# EAGLE design tinypilot_pcb (EAGLE 7.7.0)
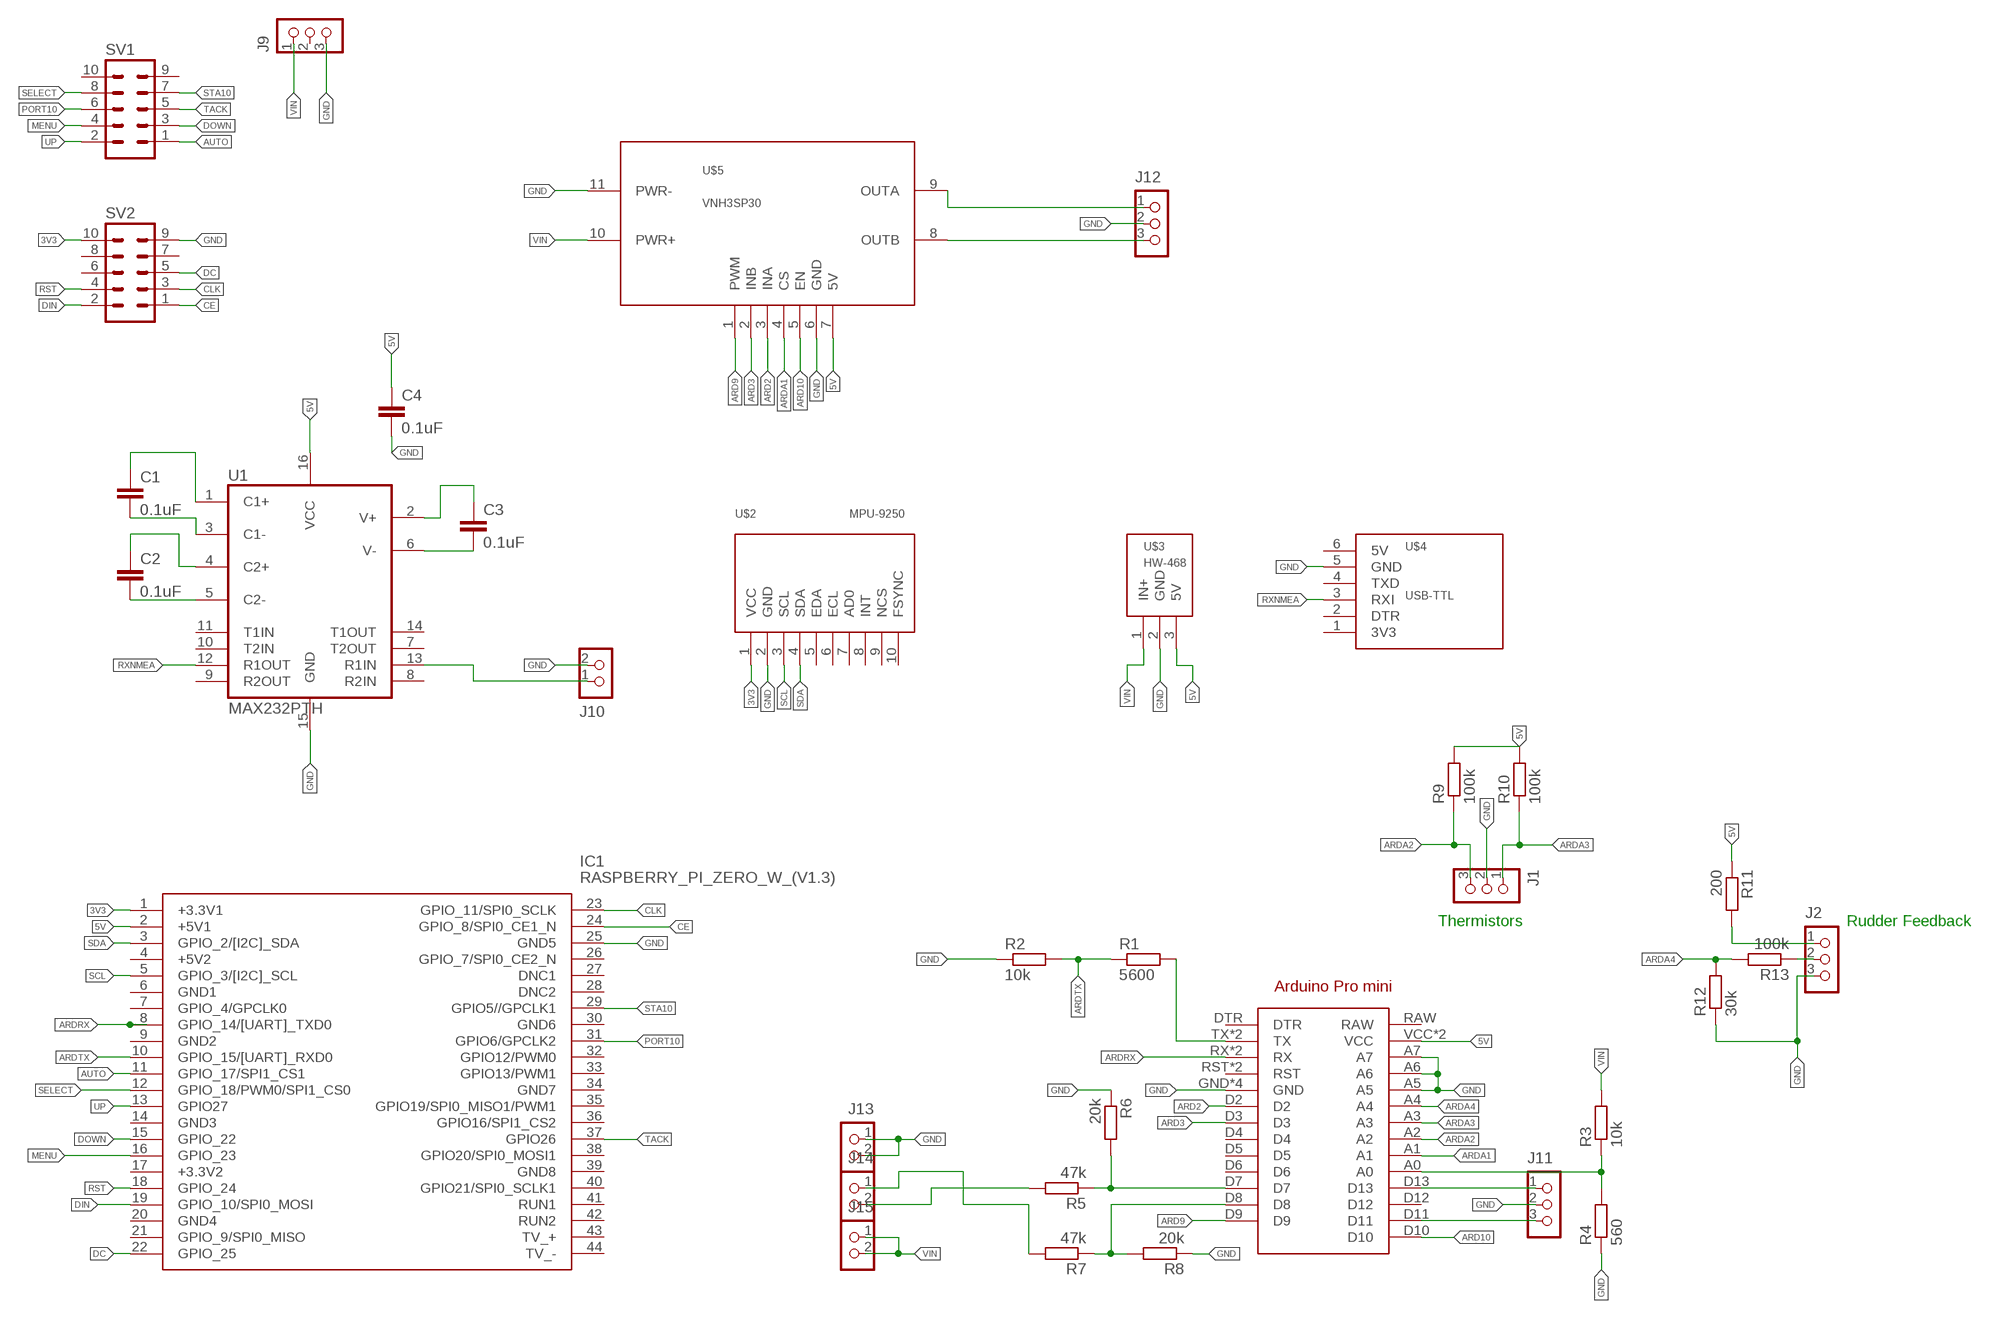
[diagram p0: schematic, sheet 1]

## Parts
ARDUINO1  ARDUINO_PRO_MINI  [ARDUINO_PRO_MINI]
C1  0.1uF  CAPPTH1  [CAP-PTH-5MM]
C2  0.1uF  CAPPTH1  [CAP-PTH-5MM]
C3  0.1uF  CAPPTH1  [CAP-PTH-5MM]
C4  0.1uF  CAPPTH1  [CAP-PTH-5MM]
IC1  RASPBERRY_PI_ZERO_W_(V1.3)  [RASPBERRYPIZEROWV13]
J1  CON_TERMINAL_BLOCK_03-5MM  [TERMINAL_BLOCK_3P_5]
J2  CON_TERMINAL_BLOCK_03-5MM  [TERMINAL_BLOCK_3P_5]
J9  CON_TERMINAL_BLOCK_03-5MM  [TERMINAL_BLOCK_3P_5]
J10  CON_TERMINAL_BLOCK_02-5MM  [TERMINAL_BLOCK_2P_5]
J11  CON_TERMINAL_BLOCK_03-5MM  [TERMINAL_BLOCK_3P_5]
J12  CON_TERMINAL_BLOCK_03-5MM  [TERMINAL_BLOCK_3P_5]
J13  CON_TERMINAL_BLOCK_02-5MM  [TERMINAL_BLOCK_2P_5]
J14  CON_TERMINAL_BLOCK_02-5MM  [TERMINAL_BLOCK_2P_5]
J15  CON_TERMINAL_BLOCK_02-5MM  [TERMINAL_BLOCK_2P_5]
R1  5600  R-EU_0207/10  [0207/10]
R2  10k  R-EU_0207/10  [0207/10]
R3  10k  R-EU_0207/10  [0207/10]
R4  560  R-EU_0207/10  [0207/10]
R5  47k  R-EU_0207/10  [0207/10]
R6  20k  R-EU_0207/10  [0207/10]
R7  47k  R-EU_0207/10  [0207/10]
R8  20k  R-EU_0207/10  [0207/10]
R9  100k  R-EU_0207/10  [0207/10]
R10  100k  R-EU_0207/10  [0207/10]
R11  200  R-EU_0207/10  [0207/10]
R12  30k  R-EU_0207/10  [0207/10]
R13  100k  R-EU_0207/10  [0207/10]
SV1  ML10  [ML10]
SV2  ML10  [ML10]
U1  MAX232PTH  [DIL16]
U$2  MPU-9250  [MPU-9250]
U$3  HW-468  [HW-468]
U$4  USB-TTL  [USB-TTL]
U$5  VNH3SP30  [VNH3SP30]

## Nets
3V3: IC1.1(+3.3V1) SV2.10 U$2.1(VCC)
5V: ARDUINO1.VCC ARDUINO1.VCC@1(VCC) C4.1 IC1.2(+5V1) R9.2 R10.2 R11.1 U1.16(VCC) U$3.3(5V) U$5.7(5V)
ARD2: ARDUINO1.D2 U$5.3(INA)
ARD3: ARDUINO1.D3 U$5.2(INB)
ARD9: ARDUINO1.D9 U$5.1(PWM)
ARD10: ARDUINO1.D10 U$5.5(EN)
ARDA1: ARDUINO1.A1 U$5.4(CS)
ARDA2: ARDUINO1.A2 J1.3 R9.1
ARDA3: ARDUINO1.A3 J1.1 R10.1
ARDA4: ARDUINO1.A4 R12.2 R13.2
ARDRX: ARDUINO1.RX ARDUINO1.RX@1(RX) IC1.8(GPIO_14/[UART]_TXD0)
ARDTX: IC1.10(GPIO_15/[UART]_RXD0) R1.1 R2.2
AUTO: IC1.11(GPIO_17/SPI1_CS1) SV1.1
CE: IC1.24(GPIO_8/SPI0_CE1_N) SV2.1
CLK: IC1.23(GPIO_11/SPI0_SCLK) SV2.3
DC: IC1.22(GPIO_25) SV2.5
DIN: IC1.19(GPIO_10/SPI0_MOSI) SV2.2
DOWN: IC1.15(GPIO_22) SV1.3
GND [GND]: ARDUINO1.A5 ARDUINO1.A6 ARDUINO1.A7 ARDUINO1.GND ARDUINO1.GND@1(GND) ARDUINO1.GND@2(GND) ARDUINO1.GND@3(GND) C4.2 IC1.25(GND5) J1.2 J2.3 J9.3 J10.2 J11.2 J12.2 J13.1 J13.2 R2.1 R4.1 R6.1 R8.1 R12.1 SV2.9 U1.15(GND) U$2.2(GND) U$3.2(GND) U$4.5(GND) U$5.6(GND) U$5.11(PWR-)
MENU: IC1.16(GPIO_23) SV1.4
N$1: C1.1 U1.1(C1+)
N$2: C1.2 U1.3(C1-)
N$3: C2.1 U1.4(C2+)
N$4: C2.2 U1.5(C2-)
N$5: C3.2 U1.6(V-)
N$6: C3.1 U1.2(V+)
N$7: J14.2 R5.2
N$8 [VIN]: J12.1 U$5.9(OUTA)
N$9 [VIN]: J12.3 U$5.8(OUTB)
N$10: ARDUINO1.D13 J11.1
N$11: ARDUINO1.D11 J11.3
N$12: ARDUINO1.A0 R3.1 R4.2
N$13: ARDUINO1.D7 R5.1 R6.2
N$14: ARDUINO1.TX ARDUINO1.TX@1(TX) R1.2
N$15: ARDUINO1.D8 R7.1 R8.2
N$17: J14.1 R7.2
N$20: J2.1 R11.2
N$21: J2.2 R13.1
PORT10: IC1.31(GPIO6/GPCLK2) SV1.6
R1IN [GND]: J10.1 U1.13(R1IN)
RST: IC1.18(GPIO_24) SV2.4
RXNMEA: U1.12(R1OUT) U$4.3(RXI)
SCL: IC1.5(GPIO_3/[I2C]_SCL) U$2.3(SCL)
SDA: IC1.3(GPIO_2/[I2C]_SDA) U$2.4(SDA)
SELECT: IC1.12(GPIO_18/PWM0/SPI1_CS0) SV1.8
STA10: IC1.29(GPIO5//GPCLK1) SV1.7
TACK: IC1.37(GPIO26) SV1.5
UP: IC1.13(GPIO27) SV1.2
VIN [VIN]: J9.1 J15.1 J15.2 R3.2 U$3.1(IN+) U$5.10(PWR+)
Unconnected: ARDUINO1.D4 ARDUINO1.D5 ARDUINO1.D6 ARDUINO1.D12 ARDUINO1.DTR ARDUINO1.RAW ARDUINO1.RST ARDUINO1.RST@1(RST) IC1.4(+5V2) IC1.6(GND1) IC1.7(GPIO_4/GPCLK0) IC1.9(GND2) IC1.14(GND3) IC1.17(+3.3V2) IC1.20(GND4) IC1.21(GPIO_9/SPI0_MISO) IC1.26(GPIO_7/SPI0_CE2_N) IC1.27(DNC1) IC1.28(DNC2) IC1.30(GND6) IC1.32(GPIO12/PWM0) IC1.33(GPIO13/PWM1) IC1.34(GND7) IC1.35(GPIO19/SPI0_MISO1/PWM1) IC1.36(GPIO16/SPI1_CS2) IC1.38(GPIO20/SPI0_MOSI1) IC1.39(GND8) IC1.40(GPIO21/SPI0_SCLK1) IC1.41(RUN1) IC1.42(RUN2) IC1.43(TV_+) IC1.44(TV_-) J9.2 SV1.9 SV1.10 SV2.6 SV2.7 SV2.8 U1.7(T2OUT) U1.8(R2IN) U1.9(R2OUT) U1.10(T2IN) U1.11(T1IN) U1.14(T1OUT) U$2.5(EDA) U$2.6(ECL) U$2.7(AD0) U$2.8(INT) U$2.9(NCS) U$2.10(FSYNC) U$4.1(3V3) U$4.2(DTR) U$4.4(TXD) U$4.6(5V)

## Notes on the sheet
- Thermistors | Rudder Feedback

## Library data of the parts
ARDUINO1 = arduinopromini:ARDUINO_PRO_MINI: For creating Arduino Pro Mini shields
C1-C4 = SparkFun:CAP: Capacitor Standard 0603 ceramic capacitor, and 0.1" leaded capacitor.
IC1 = Raspberry_Pi_Zero_W_(v1.3):RASPBERRY_PI_ZERO_W_(V1.3): Raspberry Pi Zero W (v1.3) Single-board Computers Source: Datasheet <https://cdn.sparkfun.com/assets/learn_tutorials/6/7/6/PiZero_1.pdf>; ARROW_PART_NUMBER: Raspberry Pi Zero W (v1.3); DESCRIPTION: Raspberry Pi Zero W (v1.3) Single-board Computers; HEIGHT: mm; MANUFACTURER_NAME: RASPBERRY-PI; MANUFACTURER_PART_NUMBER: Raspberry Pi Zero W (v1.3)
J1 J2 J9 J11 J12 = dp_devices.v6:CON_TERMINAL_BLOCK_03: 3 poles, wire to board connector
J10 J13-J15 = dp_devices.v6:CON_TERMINAL_BLOCK_02: 2 poles wire to board terminal block
R1-R13 = resistor:R-EU_: RESISTOR, European symbol
SV1 SV2 = con-ml:ML10: HARTING
U1 = SparkFun:MAX232: RS232 Transceiver Very common IC. This is generically called 'MAX232', but works with the 3V equivalent MAX3232 generic ICs. Field tested and mother approved. Spark Fun Electronics SKU : COM-00316 (DIP) and COM-00589 (SMD)
U$2 = Pypilot:MPU-9250
U$3 = Pypilot:HW-468
U$4 = Pypilot:USB-TTL
U$5 = Pypilot:VNH3SP30

## Net classes
0 default: width 0.635 mm, clearance 0.254 mm
1 VIN: width 2.54 mm, clearance 0.762 mm
2 GND: width 2.54 mm, clearance 0.762 mm

## Board
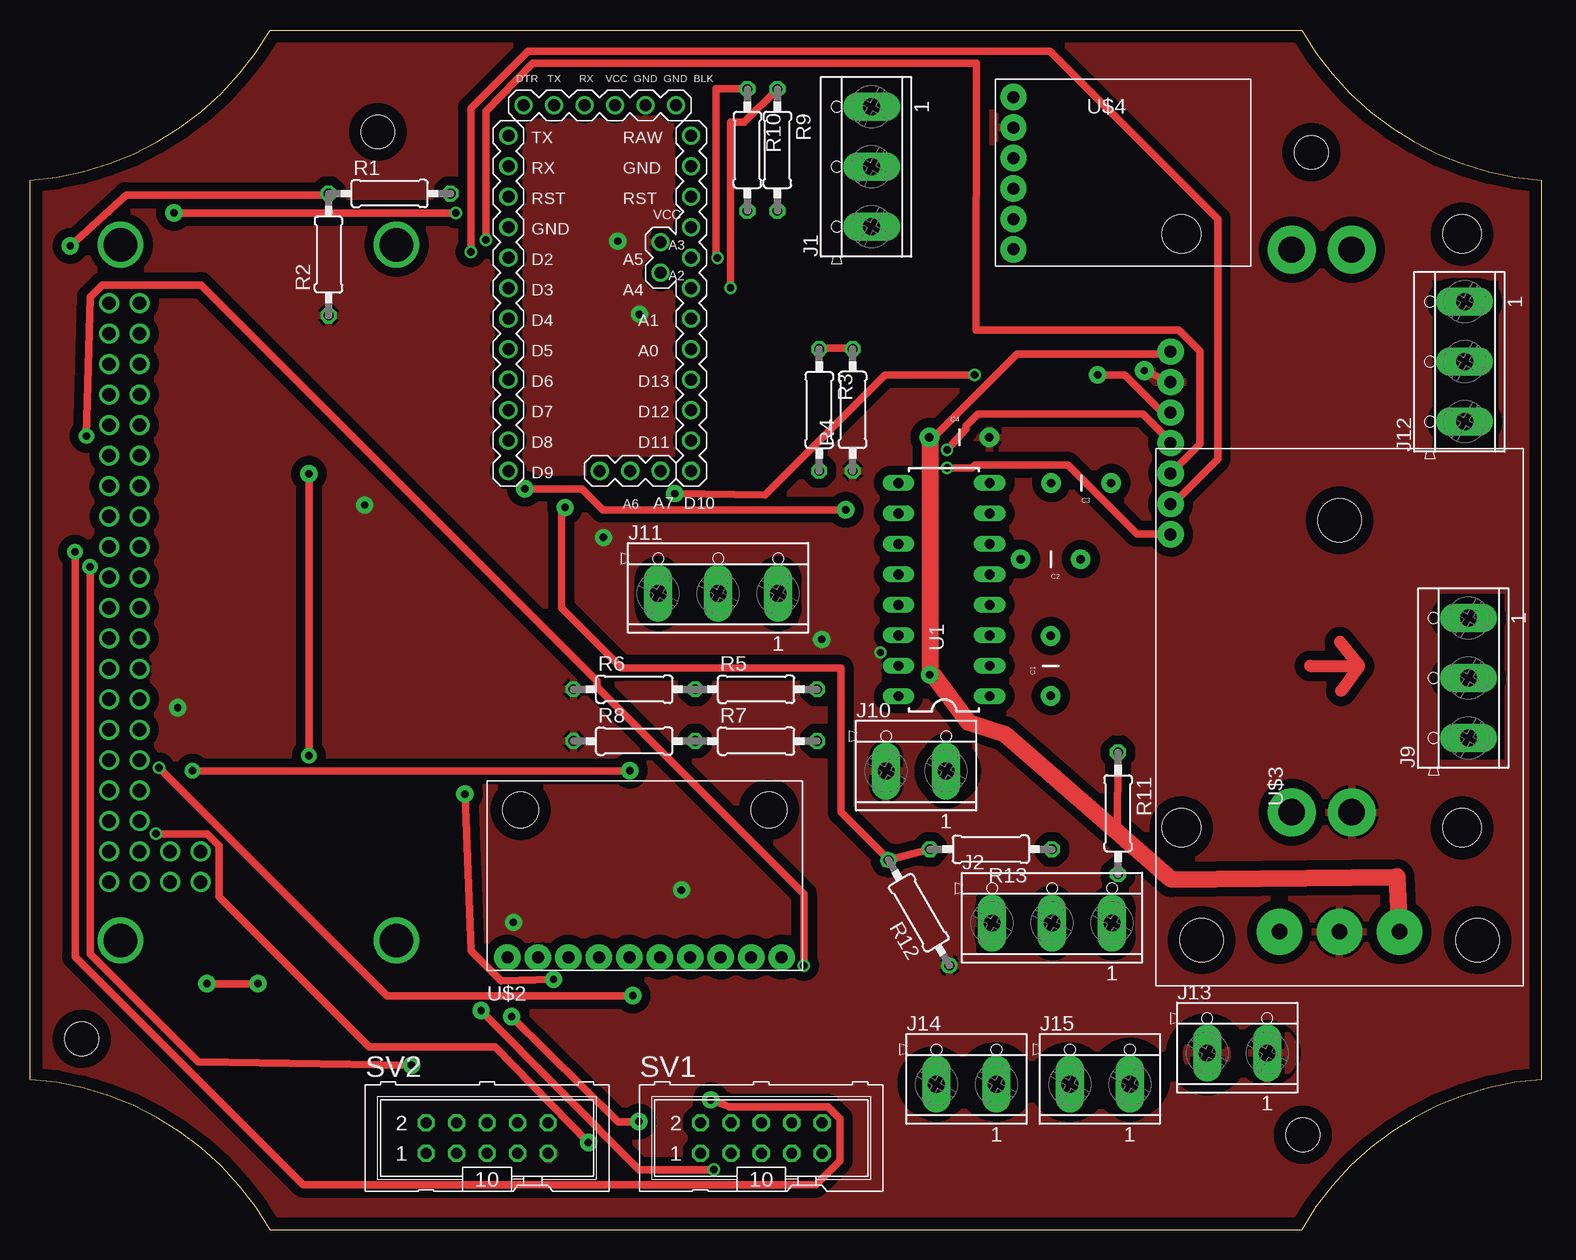
[diagram p1: board, top side]
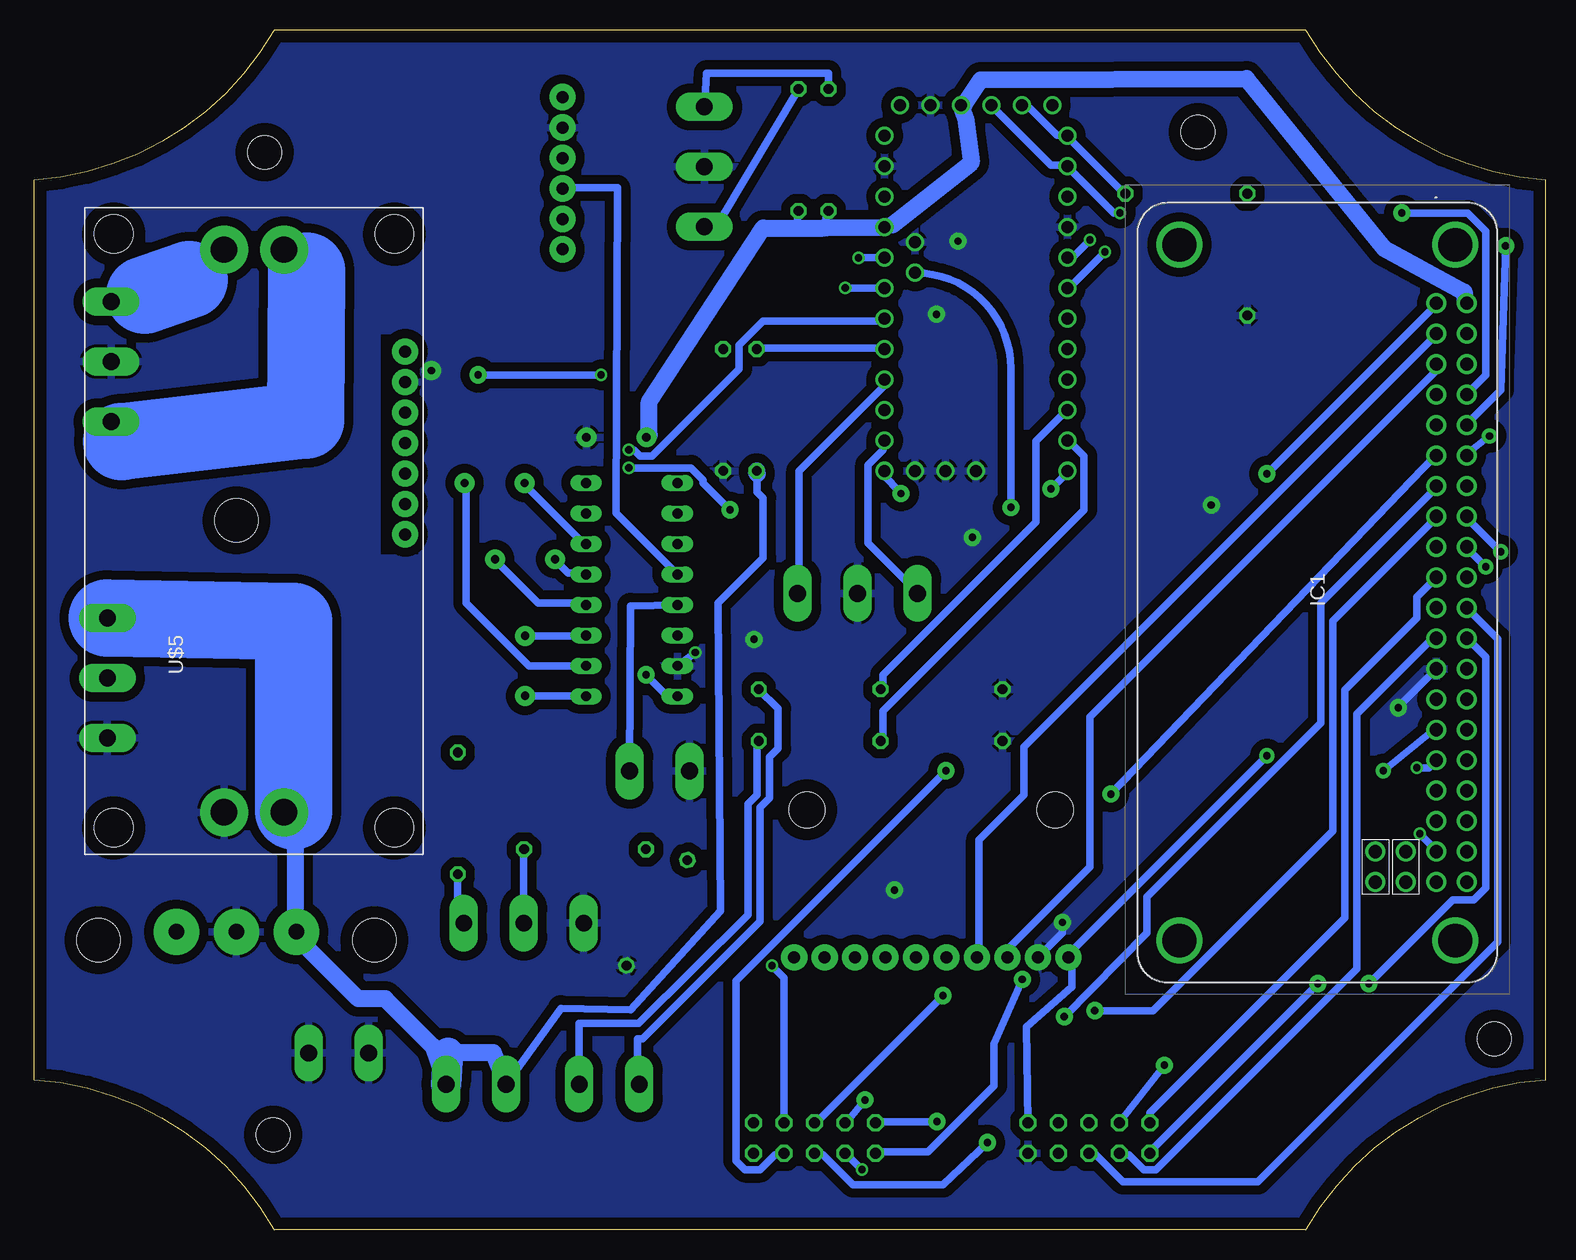
[diagram p2: board, bottom side, seen from below]

Size 126 x 100 mm. Coordinates in mm from the lower left corner, seen from the top.
Outline: 0,87.5 arc56 20,100
Outline: 106,100 arc56 126,87.5
Outline: 126,12.5 arc56 106,0
Outline: 20,0 arc56 0,12.5
Outline: 20,0 106,0
Outline: 0,12.5 0,87.5
Outline: 20,100 106,100
Outline: 126,12.5 126,87.5
Outline: 126,12.5 arc56 106,0
Outline: 20,0 arc56 0,12.5
Outline: 0,87.5 arc56 20,100
Outline: 106,100 arc56 126,87.5
Copper layers (1*16): Top 0.035mm / dielectric 1.5mm / Bottom 0.035mm
Design rules "default *": minimum track width 10mil, minimum drill 24mil, track to track 8mil, track to pad 8mil, pad to pad 8mil, via to via 8mil, smd to smd 8mil, copper to edge 40mil, drill to drill 8mil, minimum pad ring 10mil, minimum via ring 8mil, stop-mask expansion 4mil, vias tented up to drill 0mil, thermal gap 10mil
Holes 2.8 mm at 106.1,7.9 4.3,15.9 106.8,89.8 29,91.5
tRestrict: area 5.6,76.2 to 7.6,78.2; area 8,76.1 to 10.2,78.3; area 8.4,74 to 9.8,75.4; area 5.9,74 to 7.3,75.4; area 5.9,71.4 to 7.3,72.8; area 8.3,71.3 to 9.9,72.9; area 5.8,68.7 to 7.4,70.3; area 5.7,66.1 to 7.5,67.9; area 5.8,63.7 to 7.4,65.3; area 8.3,63.7 to 9.9,65.3; area 8.4,61.1 to 10,62.7; area 8.2,58.5 to 10,60.3; 49 more areas
bRestrict: area 94,56.3 to 97.1,74.6

### Footprints (pad centres in the part's own frame; a part is rotated, then mirrored left to right if it is on the bottom)
ARDUINO_PRO_MINI = drill 1: A0 11.43,-8.89; A1 11.43,-6.35; A2 11.43,-3.81; A3 11.43,-1.27; A4 8.89,-2.54; A5 8.89,0; A6 6.35,-19.05; A7 8.89,-19.05; BLK 10.16,11.43; D2 -3.81,-1.27; D3 -3.81,-3.81; D4 -3.81,-6.35; D5 -3.81,-8.89; D6 -3.81,-11.43; D7 -3.81,-13.97; D8 -3.81,-16.51; D9 -3.81,-19.05; D10 11.43,-19.05; D11 11.43,-16.51; D12 11.43,-13.97; D13 11.43,-11.43; DTR -2.54,11.43; GND -3.81,1.27; GND@1 11.43,6.35; GND@2 7.62,11.43; GND@3 3.81,-19.05; RAW 11.43,8.89; RST 11.43,3.81; RST@1 -3.81,3.81; RX -3.81,6.35; RX@1 2.54,11.43; TX -3.81,8.89; TX@1 0,11.43; VCC 11.43,1.27; VCC@1 5.08,11.43
CAP-PTH-5MM = drill 0.7 pad 1.651: 1 -2.5,0; 2 2.5,0
RASPBERRYPIZEROWV13 = drill 1.11: 1 -23.885,9.92; 2 -23.885,12.46; 3 -21.345,9.92; 4 -21.345,12.46; 5 -18.805,9.92; 6 -18.805,12.46; 7 -16.265,9.92; 8 -16.265,12.46; 9 -13.725,9.92; 10 -13.725,12.46; 11 -11.185,9.92; 12 -11.185,12.46; 13 -8.645,9.92; 14 -8.645,12.46; 15 -6.105,9.92; 16 -6.105,12.46; 17 -3.565,9.92; 18 -3.565,12.46; 19 -1.025,9.92; 20 -1.025,12.46; 21 1.515,9.92; 22 1.515,12.46; 23 4.055,9.92; 24 4.055,12.46; 25 6.595,9.92; 26 6.595,12.46; 27 9.135,9.92; 28 9.135,12.46; 29 11.675,9.92; 30 11.675,12.46; 31 14.215,9.92; 32 14.215,12.46; 33 16.755,9.92; 34 16.755,12.46; 35 19.295,9.92; 36 19.295,12.46; 37 21.835,9.92; 38 21.835,12.46; 39 24.375,9.92; 40 24.375,12.46; 41 24.375,7.38; 42 21.835,7.38; 43 21.835,4.84; 44 24.375,4.84 | drill 2.8: 45 -28.755,11.5; 46 -28.755,-11.5; 47 29.245,-11.5; 48 29.245,11.5
TERMINAL_BLOCK_3P_5 = drill 1.4 pad 2.38 long: 1 5,-0.45; 2 0,-0.45; 3 -5,-0.45
TERMINAL_BLOCK_2P_5 = drill 1.4 pad 2.38 long: 1 2.5,-0.45; 2 -2.5,-0.45
0207/10 = drill 0.813 octagon: 1 -5.08,0; 2 5.08,0
ML10 = drill 0.914 octagon: 1 -5.08,-1.27; 2 -5.08,1.27; 3 -2.54,-1.27; 4 -2.54,1.27; 5 0,-1.27; 6 0,1.27; 7 2.54,-1.27; 8 2.54,1.27; 9 5.08,-1.27; 10 5.08,1.27
DIL16 = drill 0.813 long: 1 -8.89,-3.81; 2 -6.35,-3.81; 3 -3.81,-3.81; 4 -1.27,-3.81; 5 1.27,-3.81; 6 3.81,-3.81; 7 6.35,-3.81; 8 8.89,-3.81; 9 8.89,3.81; 10 6.35,3.81; 11 3.81,3.81; 12 1.27,3.81; 13 -1.27,3.81; 14 -3.81,3.81; 15 -6.35,3.81; 16 -8.89,3.81
MPU-9250 = drill 1 pad 2.184: 1 1.7,1.1; 2 4.24,1.1; 3 6.78,1.1; 4 9.32,1.1; 5 11.86,1.1; 6 14.4,1.1; 7 16.94,1.1; 8 19.48,1.1; 9 22.02,1.1; 10 24.56,1.1 | hole 3: 2.8,13.4; 23.5,13.4
HW-468 = drill 1.3 pad 3.81: 1 4.5,20.3; 2 4.5,15.3; 3 4.5,10.3 | hole 3.6: 3.8,3.8; 3.8,26.8; 38.8,15.3
USB-TTL = drill 1 pad 2.184: 1 1.5,1.4; 2 1.5,3.94; 3 1.5,6.48; 4 1.5,9.02; 5 1.5,11.56; 6 1.5,14.1
VNH3SP30 = drill 1 pad 2.184: 1 26.66,1.5; 2 29.2,1.5; 3 31.74,1.5; 4 34.28,1.5; 5 36.82,1.5; 6 39.36,1.5; 7 41.9,1.5 | drill 2.2 pad 4: 8 50.4,11.6; 9 50.4,16.6; 10 3.5,11.6; 11 3.5,16.6 | hole 3.2: 2.2,2.4; 2.2,25.8; 51.7,25.8; 51.7,2.4

### Placement (x,y rotation side)
ARDUINO1  43.69,82.3 0 top
C1  85.09,46.99 90 top
C2  85.09,55.88 180 top
C3  87.63,62.23 180 top
C4  77.47,66.04 0 top
IC1  19.05,53.34 270 bottom
J1  69.7,88.6 90 top
J2  85.2,26 0 top
J9  119.46,45.97 90 top
J10  73.87,38.67 0 top
J11  57.37,53.48 0 top
J12  119.15,72.35 90 top
J13  100.63,15.16 0 top
J14  78.07,12.56 0 top
J15  89.18,12.56 0 top
R1  29.97,86.36 0 top
R2  24.89,81.28 90 top
R3  65.79,68.33 270 top
R4  68.58,68.33 90 top
R5  60.53,45.04 0 top
R6  50.37,45.04 0 top
R7  60.53,40.72 0 top
R8  50.37,40.72 0 top
R9  62.3,90 270 top
R10  59.8,90 270 top
R11  90.7,34.7 270 top
R12  74.1,26.4 120 top
R13  80.1,31.7 180 top
SV1  60.96,7.62 0 top
SV2  38.1,7.62 0 top
U1  76.2,53.34 90 top
U$2  38.1,21.59 0 top
U$3  124.46,20.32 90 top
U$4  80.47,80.31 0 top
U$5  93.58,31.29 90 bottom

### Tracks (layer width: path | path; a pad name or v marks a point on that pad's centre or on a via)
3V3  (via drill 0.61 pad 1.27, 0.61 pad 1.42)
  Top 0.635: v23.25,39.5 v23.25,63
  Bottom 0.635: v23.25,63 9.25,77 IC1.1 | v23.25,39.5 39.75,23 U$2.1 39.75,22.5 39.5,22.25 39.5,20.25 43.3,16.9 SV2.10
5V  (via drill 0.61 pad 1.42)
  Top 0.635: 75,66 C4.1 75.25,66 82.25,73 95,73 U$5.7 | 114.15,25 114,25 U$3.3 | 75.25,46.25 v75,46.25 | R11.1 90.64,33.13
  Top 1.422: 75,66 v75,46.25 | 114.15,25 113.95,29.4 95.15,29.2 90.64,33.13 81.25,41.3 78.2,42.3 75.25,46.25
  Bottom 0.406: R10.2 59.99,84.92 | R9.2 62.4,84.92
  Bottom 0.635: 54.5,83.75 55,83.75 ARDUINO1.VCC | 6.75,77.25 IC1.2 | 48.5,93.75 ARDUINO1.VCC@1 | v75,46.25 73.25,44.5 72.5,44.5 U1.16 | 74.75,66.25 C4.1 | 59.99,84.92 59.99,83.5 | 62.4,84.92 62.4,83.5
  Bottom 1.422: 54.5,83.75 47.9,88.95 48.4,92.7 ARDUINO1.VCC@1 | 6.75,77.25 6.8,78.15 13.5,81.8 24.95,95.95 47.1,95.85 48.5,93.75 | 74.75,66.25 74.75,69 65.25,83.5 62.4,83.5 60.25,83.5 59.99,83.5 ARDUINO1.VCC
ARD2  (via drill 0.61 pad 1.02)
  Top 0.635: v38,82.5 38,93.25 41.9,97.25 78.9,97.25 78.85,75 95.75,75 97.5,73.25 97.5,65.5 95.25,63.25 U$5.3
  Bottom 0.635: v38,82.5 39.25,81.25 39.75,81.25 ARDUINO1.D2
ARD3  (via drill 0.61 pad 1.02)
  Top 0.635: v36.75,81.5 36.75,93.5 41.5,98.25 85,98.25 99,84.25 99,64.25 95.25,60.5 U$5.2
  Bottom 0.635: v36.75,81.5 39.75,78.5 ARDUINO1.D3
ARD9  (via drill 0.61 pad 1.02, 0.61 pad 1.42)
  Top 0.635: v41.25,61.75 46,61.75 47.75,60 v68,60 | v76.45,63.5 78.5,63.5 78.75,63.75 86.5,63.75 92.25,58 95,58 U$5.1
  Bottom 0.635: v41.25,61.75 40,63 ARDUINO1.D9 | v68,60 70.25,62.25 70.25,62.5 71.25,63.5 v76.45,63.5
ARD10  (via drill 0.61 pad 1.02, 0.61 pad 1.42)
  Top 0.635: v53.75,61.35 61.25,61.25 71.25,71.25 v78.75,71.25 | v89,71.25 91.25,71.25 94.25,68.25 95,68.25 U$5.5
  Bottom 0.635: v53.75,61.35 55.25,63 ARDUINO1.D10 | v89,71.25 v78.75,71.25
ARDA1  (via drill 0.61 pad 1.02)
  Top 0.635: v76.45,65 78,66.75 78,67 79,68 92.75,68 95,65.75 U$5.4
  Bottom 0.635: v76.45,65 76,65 75.5,64.5 74.5,64.5 67.25,71.75 67.25,73.75 65.25,75.75 55.25,75.75 ARDUINO1.A1
ARDA2  (via drill 0.6 pad 1.02)
  Top 0.635: v58.4,78.5 58.4,92.3 59.52,92.3 R9.1
  Bottom 0.406: 58.4,78.49 v58.4,78.5
  Bottom 0.635: ARDUINO1.A2 58.4,78.49 | J1.3 68.8,84.2 R9.1
ARDA3  (via drill 0.6 pad 1.02)
  Top 0.406: v57.3,81 57.2,81 | 59.8,95.1 R10.1
  Top 0.635: 57.2,81 57.2,95.1 59.8,95.1
  Bottom 0.406: 57.3,81.03 v57.3,81
  Bottom 0.635: ARDUINO1.A3 57.3,81.03 | R10.1 59.8,96.4 69.95,96.4 J1.1
ARDA4  (via drill 0.6 pad 1.42)
  Top 0.635: R13.2 R12.2 71.56,30.84 67.6,34.8 67.6,46.8 49.3,46.8 44.3,51.8 44.3,59.9 v44.6,60.2
  Bottom 0.635: v44.6,60.2 44.6,71.78 arc-90 ARDUINO1.A4
ARDRX  (via drill 0.61 pad 1.02, 0.61 pad 1.42)
  Top 0.635: v35.5,84.75 v12,84.75
  Bottom 0.635: ARDUINO1.RX@1 46,93.5 41.25,88.75 40,88.75 ARDUINO1.RX 39.75,88.5 36,84.75 v35.5,84.75 | v12,84.75 6.5,84.75 5,83.25 5,71.25 6.5,69.75 IC1.8
ARDTX  (via drill 0.61 pad 1.42)
  Top 0.635: 25,86.5 R2.2 24.75,86.25 8,86.25 v3.35,82
  Bottom 0.635: v3.35,82 3.75,70 6.5,67.25 IC1.10
AUTO  (via drill 0.61 pad 1.42)
  Top 0.635: v43.65,20.85 39.25,20.75 36.75,23.25 v36.25,36.3
  Bottom 0.635: v43.65,20.85 46,15.5 46,12 51.5,6.5 55.75,6.5 SV1.1 | v36.25,36.3 9.25,64.5 IC1.11
CE  (via drill 0.61 pad 1.42)
  Top 0.635: v14.75,20.5 v19,20.5
  Bottom 0.635: v19,20.5 33,6.5 SV2.1 | v14.75,20.5 7.75,27.5 6,27.5 5,28.5 5,47.75 6.5,49.25 IC1.24
CLK
  Bottom 0.635: SV2.3 35.5,6.25 34.75,6.25 33.5,5 32.5,5 15.75,21.75 15.75,43 9.25,49.5 IC1.23
DC
  Bottom 0.635: SV2.5 38,6.25 37.5,6.25 35.25,4 24,4 4,24 4,49.25 6.5,51.75 IC1.22
DIN
  Bottom 0.635: SV2.2 33,9 33,9.75 16.75,26 16.75,45 10.75,51 10.75,52.75 9.25,54.25 IC1.19
DOWN  (via drill 0.61 pad 1.02, 0.61 pad 1.42)
  Top 0.635: v57,5 50.75,5 v37.6,18.25
  Bottom 0.635: v57,5 58.25,6.25 SV1.3 | v37.6,18.25 32.75,18.25 17.75,33.25 17.75,50.75 9.25,59.25 IC1.15
GND  (via drill 0.6 pad 1.02, 0.6 pad 1.42, 0.6 pad 1.61)
  Top 0.635: v92.9,71.6 U$5.6
  Bottom 0.254: v12.3,43.5 12.3,43.58
  Bottom 0.635: v40.3,25.6 40.3,24.73 U$2.2 | 12.3,43.58 IC1.25 | v70.9,48.1 U1.15
  other vias: 54.3,28.3 27.9,60.4 47.8,57.7 66,49.2 49,82.4 50.8,76.3
  pour Top: -5.08,0 -5.08,104.14 137.16,101.6 134.62,-7.62 -5.08,-5.08
  pour Bottom: -5.08,0 -5.08,104.14 132.08,101.6 139.7,-5.08 -5.08,-2.54
MENU  (via drill 0.61 pad 1.27, 0.61 pad 1.42)
  Top 0.635: v56.75,10.8 57.9,10.4 58.25,10.25 66.5,10.25 67.5,9.25 67.5,5.75 65.5,3.75 22.75,3.75 3.75,22.75 v3.75,56.5
  Bottom 0.635: v56.75,10.8 58.25,9 SV1.4 | v3.75,56.5 6.5,59.25 IC1.16
N$1
  Bottom 0.635: U1.1 80.25,44.5 85,44.5 C1.1
N$2
  Bottom 0.635: U1.3 80.25,49.5 85,49.5 C1.2
N$3
  Bottom 0.635: U1.4 80.25,52.25 84,52.25 87.5,55.75 C2.1
N$4
  Bottom 0.635: U1.5 80.25,54.75 81.5,54.75 82.5,55.75 C2.2
N$5
  Bottom 0.635: U1.6 80.25,57.25 85,62 C3.2
N$6
  Bottom 0.635: U1.2 80.25,47 84.75,47 90,52.25 90,62 C3.1
N$7
  Bottom 0.635: J14.2 75.7,12.11 75.7,15.9 75.3,15.9 65.5,25.7 65.5,35.2 64.7,36 64.7,39.4 64,40.1 64,43.43 R5.2
N$8
  Bottom 1.016: 110.25,81.5 113.1,79.2 | 116.8,77.9 J12.1
  Bottom 2.54: 110.25,81.5 U$5.9
  Bottom 6.452: 113.1,79.2 116.8,77.9
N$9
  Bottom 1.422: U$5.8 103.3,79.9 | 118.7,65.7 J12.3
  Bottom 6.452: 103.3,79.9 103.4,67.5 118.7,65.7
N$10
  Bottom 0.635: ARDUINO1.D13 55.25,70.75 55.25,70.25 62.25,63.25 62.25,53.25 J11.1
N$11
  Bottom 0.635: ARDUINO1.D11 55.25,65.75 55.25,65 56.5,63.75 56.5,57.25 52.5,53.25 J11.3
N$12
  Top 0.635: R3.1 66,73.5 68.5,73.5 R4.2
  Bottom 0.635: ARDUINO1.A0 55.25,73.5 65.75,73.5 R3.1
N$13
  Top 0.635: 55.5,45 R6.2
  Bottom 0.635: R6.2 55.25,45.25 55.25,46.25 42.5,59 42.5,65.75 40,68.25 ARDUINO1.D7
N$14
  Bottom 0.635: R1.2 35.25,86.5 39.75,91 ARDUINO1.TX 40,91.25 40.75,91.25 43,93.5 43.5,93.5 ARDUINO1.TX@1
N$15
  Top 0.635: 55.5,40.75 R8.2
  Bottom 0.635: R8.2 55.25,40.75 55.25,43.25 38.5,60 38.5,64.5 39.75,65.75 ARDUINO1.D8
N$17
  Bottom 0.635: R7.2 65.75,40.5 65.75,36.25 66.5,35.5 66.5,26.25 75.65,17.2 80.57,17.2 J14.1
N$18
  Top 1: 106.7,47 110.8,47 | 110.8,47 109.2,49 | 110.8,47 109.3,44.9
N$20
  Bottom 0.635: J2.1 90.7,26.05 R11.2
N$21
  Bottom 0.635: R13.1 85.2,31.68 J2.2
PORT10  (via drill 0.61 pad 1.02, 0.61 pad 1.42)
  Top 0.635: v50.25,19.5 29.75,19.5 v10.75,38.5
  Bottom 0.635: v50.25,19.5 60.75,9 SV1.6 | v10.75,38.5 9.75,38.5 9.25,39 IC1.31
R1IN
  Bottom 0.635: J10.1 76.3,52 U1.13
RST  (via drill 0.61 pad 1.27, 0.61 pad 1.42)
  Top 0.635: v31.8,13.7 14,14 5,23 v5,55.25
  Bottom 0.635: v31.8,13.7 35.5,9 SV2.4 | v5,55.25 6.5,56.75 IC1.18
RXNMEA
  Bottom 0.635: U1.12 72.5,54.75 77.5,59.75 77.4,86.85 81.6,86.85 U$4.3
SCL
  Bottom 0.635: IC1.5 9.25,72 9.25,71.5 38,42.75 38,30.25 44.75,23.5 44.75,22.75 U$2.3
SDA
  Bottom 0.635: IC1.3 9.25,74.5 43.5,40.25 43.5,36.25 47.25,32.5 47.25,22.75 U$2.4
SELECT  (via drill 0.61, 0.61 pad 1.27)
  Top 0.635: v64.5,22 64.5,28 47.25,45.25 47.25,45.75 14.25,78.75 6,78.75 5,77.75 v4.7,66.15
  Bottom 0.635: SV1.8 63.5,21 v64.5,22 | v4.7,66.15 6.5,64.75 IC1.12
STA10  (via drill 0.61 pad 1.27, 0.61 pad 1.42)
  Top 0.635: v13.55,38.25 v50,38.25
  Bottom 0.635: v50,38.25 67.5,20.75 67.5,5.75 66.75,5 65.5,5 64.25,6.25 63.5,6.25 SV1.7 | v13.55,38.25 9.25,41.75 IC1.29
TACK  (via drill 0.61 pad 1.02, 0.61 pad 1.42)
  Top 0.635: v46.55,7.25 38.75,15.25 28.25,15.25 15.75,27.75 15.75,32 14.75,33 v10.5,33
  Bottom 0.635: v46.55,7.25 50.25,3.75 57.75,3.75 60.25,6.25 60.75,6.25 SV1.5 | v10.5,33 9.25,31.75 IC1.37
UP  (via drill 0.61 pad 1.42)
  Top 0.635: v50.75,9 49,9 v40.15,17.75
  Bottom 0.635: v50.75,9 55.75,9 SV1.2 | v40.15,17.75 33.25,24.75 33.25,27.75 18.75,42.25 18.75,52.25 9.25,61.75 IC1.13
VIN
  Bottom 0.635: 65.75,63 65.75,61.5 65.25,61 65.25,56 69,52.25 68.8,26.55 76.3,18.3 82.1,18.45 J15.2
  Bottom 1.422: 104.25,34 104.25,25 | 65.75,63 R3.2 | 91.5,14.75 87.75,14.75 J15.2 | U$3.1 103.5,23.75 99,19.25 96.75,19.25 92.75,15.25 J15.1 | 104.4,34.9 U$5.10
  Bottom 2.54: 104.25,25 U$3.1 | 104.25,34 U$5.10 | 91.5,14.75 J15.1
  Bottom 6.452: J9.1 104.4,50.7 104.4,34.9

### Text on the board
dxf: B | GND | A | D11 | D13 | POWER IN | VIN | GND | 10-17V DC | KgPilot v1.0 | VIN GND | GND | NMEA IN | GND | GND | Signal | 5V | VIN GND 5V | Rudder Poss | BUTTONS | SCREEN | GND | L/R | VIN | Rudder sensors 12V